# EAGLE schematic D1 (EAGLE 7.1.0)
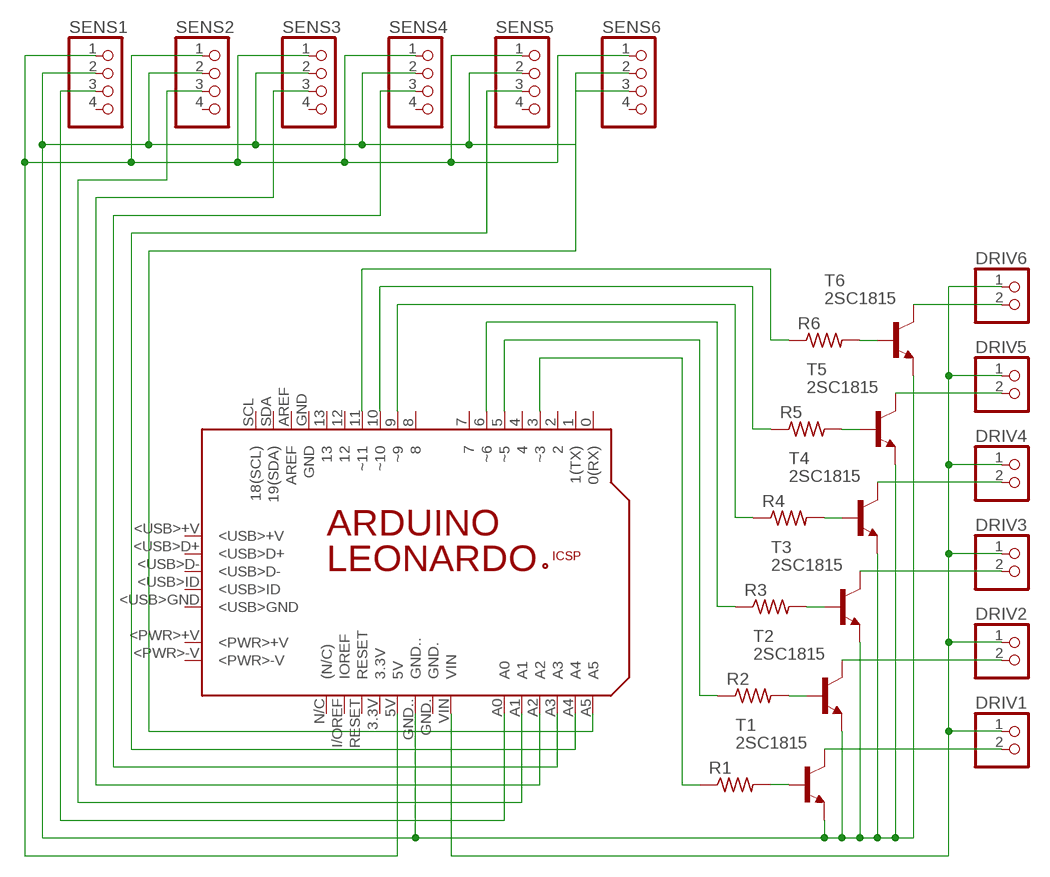
[diagram p0: schematic, sheet 1]

## Parts
DRIV1  PINHD-1X2  [1X02]
DRIV2  PINHD-1X2  [1X02]
DRIV3  PINHD-1X2  [1X02]
DRIV4  PINHD-1X2  [1X02]
DRIV5  PINHD-1X2  [1X02]
DRIV6  PINHD-1X2  [1X02]
PCB2  ARDUINO_LEONARDO  [ARDUINO_LEONARDO]
R1  R-US_0204/5  [0204/5]
R2  R-US_0204/5  [0204/5]
R3  R-US_0204/5  [0204/5]
R4  R-US_0204/5  [0204/5]
R5  R-US_0204/5  [0204/5]
R6  R-US_0204/5  [0204/5]
SENS1  PINHD-1X4  [1X04]
SENS2  PINHD-1X4  [1X04]
SENS3  PINHD-1X4  [1X04]
SENS4  PINHD-1X4  [1X04]
SENS5  PINHD-1X4  [1X04]
SENS6  PINHD-1X4  [1X04]
T1  2SC1815  [TO92-ECB]
T2  2SC1815  [TO92-ECB]
T3  2SC1815  [TO92-ECB]
T4  2SC1815  [TO92-ECB]
T5  2SC1815  [TO92-ECB]
T6  2SC1815  [TO92-ECB]

## Nets
N$1: PCB2.5V SENS1.1 SENS2.1 SENS3.1 SENS4.1 SENS5.1 SENS6.1
N$2: PCB2.5(~5) R2.1
N$3: PCB2.6(~6) R3.1
N$4: PCB2.9(~9) R4.1
N$5: PCB2.10(~10) R5.1
N$6: PCB2.3(~3) R1.1
N$7: DRIV1.2 T1.C
N$8: PCB2.11(~11) R6.1
N$9: PCB2.A0 SENS1.3
N$10: PCB2.A1 SENS2.3
N$11: PCB2.A2 SENS3.3
N$12: PCB2.A3 SENS4.3
N$13: PCB2.A4 SENS5.3
N$14: PCB2.A5 SENS6.3
N$15: DRIV2.2 T2.C
N$16: R1.2 T1.B
N$17: R3.2 T3.B
N$18: R2.2 T2.B
N$19: R4.2 T4.B
N$20: R5.2 T5.B
N$21: R6.2 T6.B
N$22: DRIV3.2 T3.C
N$23: DRIV4.2 T4.C
N$24: DRIV5.2 T5.C
N$25: DRIV6.2 T6.C
N$26: DRIV1.1 DRIV2.1 DRIV3.1 DRIV4.1 DRIV5.1 DRIV6.1 PCB2.VIN
N$28: PCB2.GND.. SENS1.2 SENS2.2 SENS3.2 SENS4.2 SENS5.2 SENS6.2 T1.E T2.E T3.E T4.E T5.E T6.E
Unconnected: PCB2.0(0(RX)) PCB2.1(1(TX)) PCB2.2 PCB2.3.3V PCB2.4 PCB2.7 PCB2.8 PCB2.12 PCB2.13 PCB2.+5V PCB2.<PWR>+V PCB2.<PWR>-V PCB2.<USB>+V PCB2.<USB>D+ PCB2.<USB>D- PCB2.<USB>GND PCB2.<USB>ID PCB2.AREF PCB2.GND PCB2.GND. PCB2.GND_ PCB2.I/OREF(IOREF) PCB2.MISO PCB2.MOSI PCB2.N/C((N/C)) PCB2.RESET PCB2.RESET. PCB2.SCK PCB2.SCL(18(SCL)) PCB2.SDA(19(SDA)) SENS1.4 SENS2.4 SENS3.4 SENS4.4 SENS5.4 SENS6.4

## Library data of the parts
DRIV1-DRIV6 = pinhead:PINHD-1X2: PIN HEADER
PCB2 = E14_Arduino_published:ARDUINO_LEONARDO: Device for representing an Arduino Leonardo board with a footprint in an EAGLE design. Created by Dave Young for Element14. More EAGLE documentation at: http://www.element14.com/community/community/knode/cadsoft_eagle
R1-R6 = resistor:R-US_: RESISTOR, American symbol
SENS1-SENS6 = pinhead:PINHD-1X4: PIN HEADER
T1-T6 = transistor:2SC1815: NPN EPITAXIAL TRANSISTOR Source: TOSHIBA .. 2SC1815 1.pdf